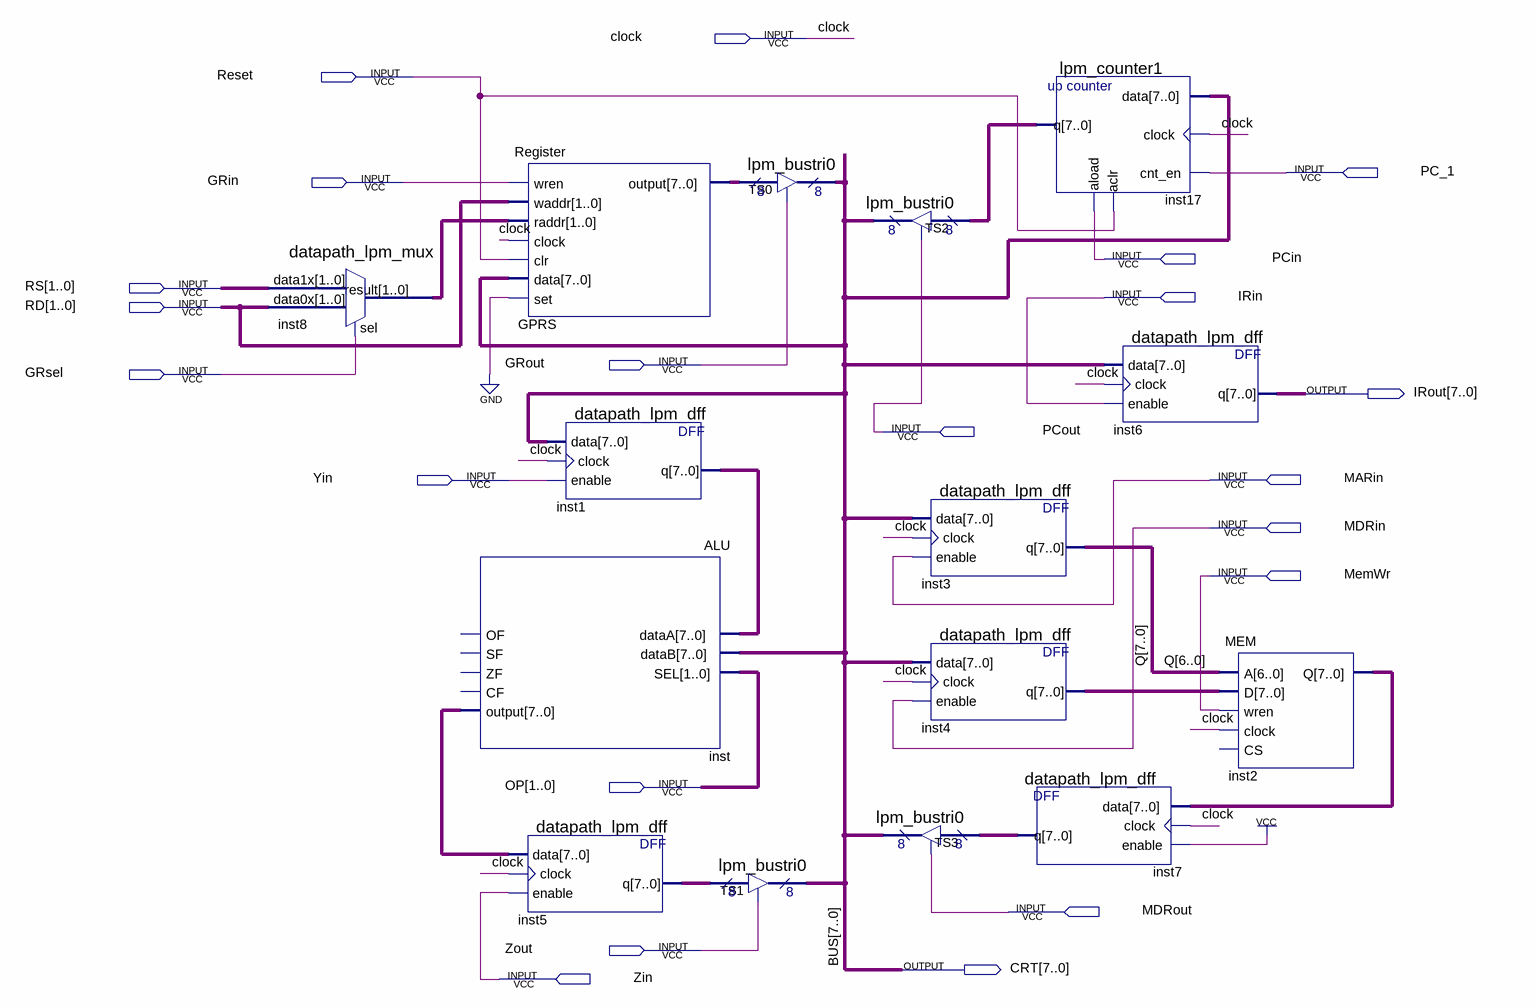
[diagram p0: schematic sheet]
// Quartus schematic DataPath.bdf as structural Verilog: 15 symbols, 21 pins
module DataPath (
  input  clock,
  input  Reset,
  input  PC_1,
  input  GRin,
  input  PCin,
  input  [1:0] RS,
  input  IRin,
  input  [1:0] RD,
  input  GRout,
  input  GRsel,
  input  PCout,
  input  Yin,
  input  MARin,
  input  MDRin,
  input  MemWr,
  input  [1:0] OP,
  input  MDRout,
  input  Zout,
  input  Zin,
  output [7:0] IRout,
  output [7:0] CRT
);

  wire [1:0] inst8_result;
  wire [7:0] GPRS_output, inst1_q, inst2_q, inst4_q, inst5_q, inst7_q, inst17_q, inst_output, Q;

  datapath_lpm_mux inst8 (.data1x(RS), .data0x(RD), .sel(GRsel), .result(inst8_result));
  Register GPRS (
    .wren(GRin), .waddr(RD), .raddr(inst8_result), .clock(clock), .clr(Reset), .data(CRT), .set(1'b0),
    .\output (GPRS_output));
  ALU inst (.dataA(inst1_q), .dataB(CRT), .SEL(OP), .\output (inst_output));  // open: OF, SF, ZF, CF
  datapath_lpm_dff inst5 (.data(inst_output), .clock(clock), .enable(Zin), .q(inst5_q));
  datapath_lpm_dff inst1 (.data(CRT), .clock(clock), .enable(Yin), .q(inst1_q));
  lpm_bustri0 TS0 (.enabledt(GRout), .data(GPRS_output), .tridata(CRT));
  lpm_bustri0 TS1 (.enabledt(Zout), .data(inst5_q), .tridata(CRT));
  lpm_bustri0 TS2 (.enabledt(PCout), .data(inst17_q), .tridata(CRT));
  datapath_lpm_dff inst3 (.data(CRT), .clock(clock), .enable(MARin), .q(Q));
  datapath_lpm_dff inst4 (.data(CRT), .clock(clock), .enable(MDRin), .q(inst4_q));
  lpm_bustri0 TS3 (.enabledt(MDRout), .data(inst7_q), .tridata(CRT));
  lpm_counter1 inst17 (.data(CRT), .clock(clock), .cnt_en(PC_1), .aclr(Reset), .aload(PCin), .q(inst17_q));
  datapath_lpm_dff inst7 (.data(inst2_q), .clock(clock), .enable(1'b1), .q(inst7_q));
  datapath_lpm_dff inst6 (.data(CRT), .clock(clock), .enable(IRin), .q(IRout));
  MEM inst2 (.A(Q[6:0]), .D(inst4_q), .wren(MemWr), .clock(clock), .Q(inst2_q));  // open: CS

  // Other names for the same wires on the sheet: BUS[7:0] = CRT
endmodule
